# Altium schematic sheet fpga_board.SchDoc
size A4
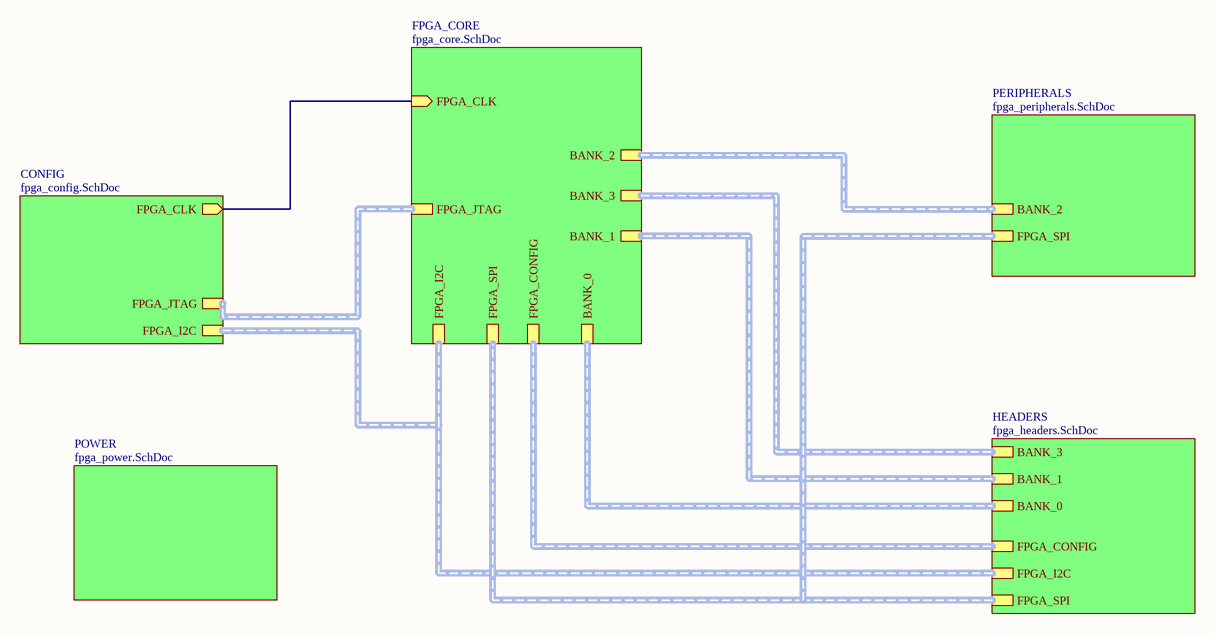
[diagram p0: fpga_board.SchDoc]

## Sub-sheets
CONFIG = fpga_config.SchDoc: FPGA_JTAG (harness FPGA_JTAG), FPGA_I2C (harness FPGA_I2C), FPGA_CLK (out)
FPGA_CORE = fpga_core.SchDoc: BANK_2 (harness BANK_2), BANK_3 (harness BANK_3), BANK_1 (harness BANK_1), BANK_0 (harness BANK_0), FPGA_I2C (harness FPGA_I2C), FPGA_SPI (harness FPGA_SPI), FPGA_JTAG (harness FPGA_JTAG), FPGA_CONFIG (harness FPGA_CONFIG), FPGA_CLK (in)
HEADERS = fpga_headers.SchDoc: FPGA_I2C (harness FPGA_I2C), BANK_1 (harness BANK_1), FPGA_SPI (harness FPGA_SPI), BANK_3, FPGA_CONFIG, BANK_0
PERIPHERALS = fpga_peripherals.SchDoc: FPGA_SPI, BANK_2
POWER = fpga_power.SchDoc: no entries

## Nets
(unnamed): sheet FPGA_CORE/FPGA_CLK, sheet CONFIG/FPGA_CLK

## Buses and harness runs
harness sheet CONFIG/FPGA_I2C = sheet FPGA_CORE/FPGA_I2C = sheet HEADERS/FPGA_I2C
harness sheet CONFIG/FPGA_JTAG = sheet FPGA_CORE/FPGA_JTAG
harness sheet FPGA_CORE/BANK_0 = sheet HEADERS/BANK_0
harness sheet FPGA_CORE/BANK_1 = sheet HEADERS/BANK_1
harness sheet FPGA_CORE/BANK_2 = sheet PERIPHERALS/BANK_2
harness sheet FPGA_CORE/BANK_3 = sheet HEADERS/BANK_3
harness sheet FPGA_CORE/FPGA_CONFIG = sheet HEADERS/FPGA_CONFIG
harness sheet FPGA_CORE/FPGA_SPI = sheet HEADERS/FPGA_SPI = sheet PERIPHERALS/FPGA_SPI